# EAGLE schematic badge (EAGLE 7.7.0)

## Sheet 1 of 2
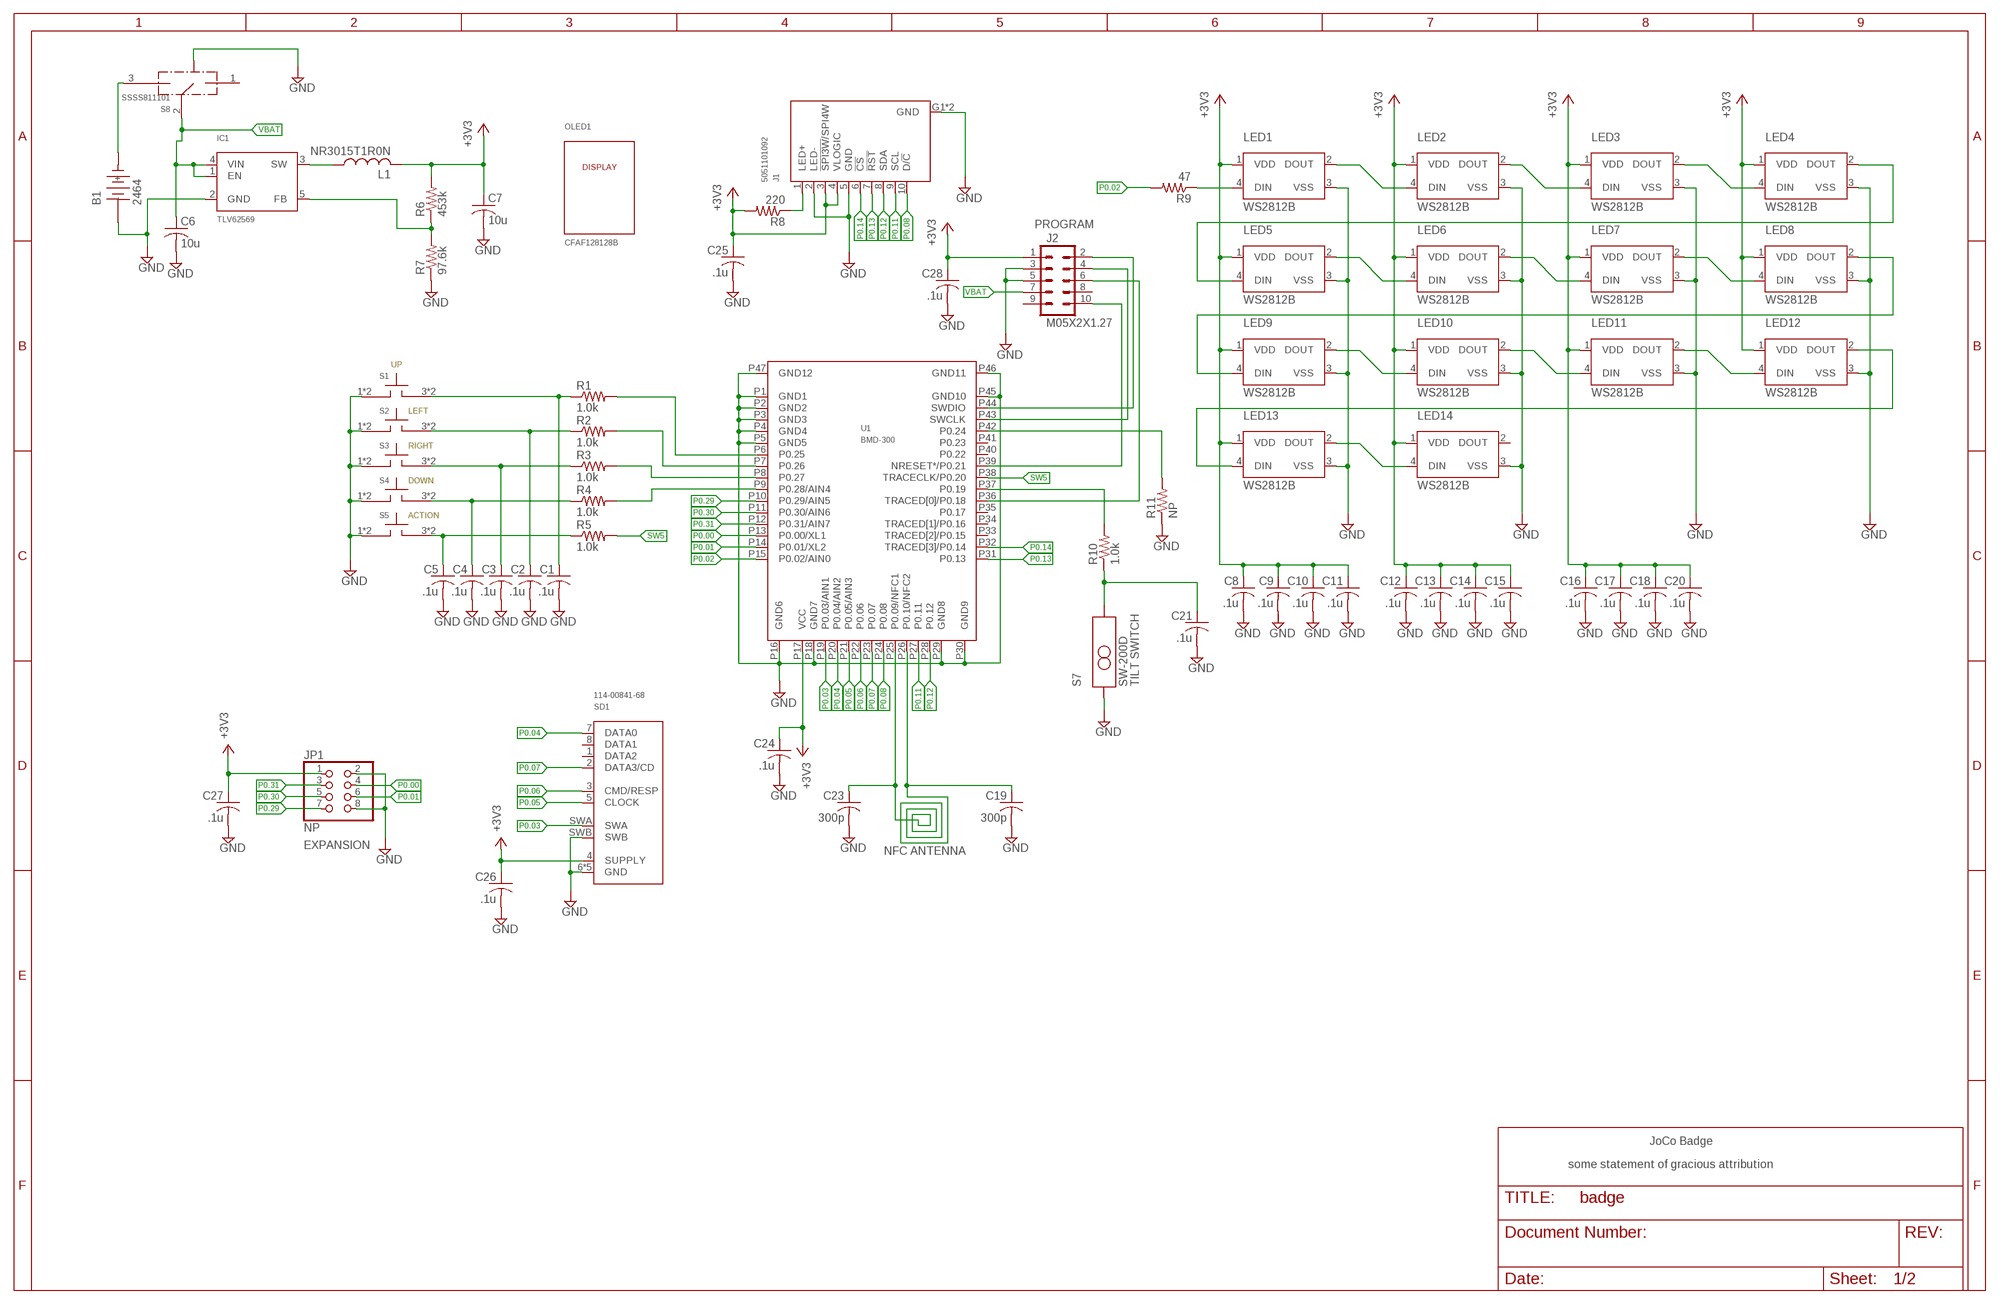
[diagram p0: schematic, sheet 1]

### Parts
B1  2464  [2464]
C1  .1u  C-USC0402K  [C0402K]
C2  .1u  C-USC0402K  [C0402K]
C3  .1u  C-USC0402K  [C0402K]
C4  .1u  C-USC0402K  [C0402K]
C5  .1u  C-USC0402K  [C0402K]
C6  10u  C-USC0805K  [C0805K]
C7  10u  C-USC0805K  [C0805K]
C8  .1u  C-USC0402K  [C0402K]
C9  .1u  C-USC0402K  [C0402K]
C10  .1u  C-USC0402K  [C0402K]
C11  .1u  C-USC0402K  [C0402K]
C12  .1u  C-USC0402K  [C0402K]
C13  .1u  C-USC0402K  [C0402K]
C14  .1u  C-USC0402K  [C0402K]
C15  .1u  C-USC0402K  [C0402K]
C16  .1u  C-USC0402K  [C0402K]
C17  .1u  C-USC0402K  [C0402K]
C18  .1u  C-USC0402K  [C0402K]
C19  300p  C-USC0603K  [C0603K]
C20  .1u  C-USC0402K  [C0402K]
C21  .1u  C-USC0402K  [C0402K]
C23  300p  C-USC0603K  [C0603K]
C24  .1u  C-USC0402K  [C0402K]
C25  .1u  C-USC0402K  [C0402K]
C26  .1u  C-USC0402K  [C0402K]
C27  .1u  C-USC0402K  [C0402K]
C28  .1u  C-USC0402K  [C0402K]
IC1  TLV62569  [DBV-5]
J1  5051101092  [5051101092]
J2  M05X2X1.27  [2X5X1.27]
JP1  NP  PINHD-2X4  [2X04]
L1  NR3015T1R0N  NR3015  [NR3015]
LED1  WS2812B  [WS2812B]
LED2  WS2812B  [WS2812B]
LED3  WS2812B  [WS2812B]
LED4  WS2812B  [WS2812B]
LED5  WS2812B  [WS2812B]
LED6  WS2812B  [WS2812B]
LED7  WS2812B  [WS2812B]
LED8  WS2812B  [WS2812B]
LED9  WS2812B  [WS2812B]
LED10  WS2812B  [WS2812B]
LED11  WS2812B  [WS2812B]
LED12  WS2812B  [WS2812B]
LED13  WS2812B  [WS2812B]
LED14  WS2812B  [WS2812B]
OLED1  CFAF128128B  [CFAF128128B]
R1  1.0k  R-US_R0603  [R0603]
R2  1.0k  R-US_R0603  [R0603]
R3  1.0k  R-US_R0603  [R0603]
R4  1.0k  R-US_R0603  [R0603]
R5  1.0k  R-US_R0603  [R0603]
R6  453k  R-US_R0603  [R0603]
R7  97.6k  R-US_R0603  [R0603]
R8  220  R-US_R0603  [R0603]
R9  47  R-US_R0603  [R0603]
R10  1.0k  R-US_R0603  [R0603]
R11  NP  R-US_R0805  [R0805]
S1  PTS810  [PTS810]
S2  PTS810  [PTS810]
S3  PTS810  [PTS810]
S4  PTS810  [PTS810]
S5  PTS810  [PTS810]
S7  SW-200D  [SW-200D]
S8  SSSS811101  [SSSS811101]
SD1  114-00841-68  [114-00841-68]
U1  BMD-300  [BMD-300]

### Nets
!RESET: J2.10 U1.P39(NRESET*/P0.21)
+3V3: C7.1 C8.1 C9.1 C10.1 C11.1 C12.1 C13.1 C14.1 C15.1 C16.1 C17.1 C18.1 C20.1 C24.1 C25.1 C26.1 C27.1 C28.1 J1.3(!SPI3W!/SPI4W) J1.4(VLOGIC) J2.1 JP1.1 L1.2 LED1.1(VDD) LED2.1(VDD) LED3.1(VDD) LED4.1(VDD) LED5.1(VDD) LED6.1(VDD) LED7.1(VDD) LED8.1(VDD) LED9.1(VDD) LED10.1(VDD) LED11.1(VDD) LED12.1(VDD) LED13.1(VDD) LED14.1(VDD) R6.2 R8.2 SD1.4(SUPPLY) U1.P17(VCC)
ANT: C19.1 C23.1 U1.P25(P0.09/NFC1) U1.P26(P0.10/NFC2)
FB: IC1.5(FB) R6.1 R7.2
GND: B1.- C1.2 C2.2 C3.2 C4.2 C5.2 C6.2 C7.2 C8.2 C9.2 C10.2 C11.2 C12.2 C13.2 C14.2 C15.2 C16.2 C17.2 C18.2 C19.2 C20.2 C21.2 C23.2 C24.2 C25.2 C26.2 C27.2 C28.2 IC1.2(GND) J1.2(LED-) J1.5(GND) J1.G1(GND) J1.G2(GND) J2.3 J2.5 JP1.2 JP1.8 LED1.3(VSS) LED2.3(VSS) LED3.3(VSS) LED4.3(VSS) LED5.3(VSS) LED6.3(VSS) LED7.3(VSS) LED8.3(VSS) LED9.3(VSS) LED10.3(VSS) LED11.3(VSS) LED12.3(VSS) LED13.3(VSS) LED14.3(VSS) R7.1 R11.1 S1.1(A) S1.2(A) S2.1(A) S2.2(A) S3.1(A) S3.2(A) S4.1(A) S4.2(A) S5.1(A) S5.2(A) S7.A S8.G1(GND) S8.G2(GND) S8.G3(GND) S8.G4(GND) SD1.6(GND) SD1.G1(GND) SD1.G2(GND) SD1.G3(GND) SD1.G4(GND) SD1.SWB U1.P1(GND1) U1.P2(GND2) U1.P3(GND3) U1.P4(GND4) U1.P5(GND5) U1.P16(GND6) U1.P18(GND7) U1.P29(GND8) U1.P30(GND9) U1.P45(GND10) U1.P46(GND11) U1.P47(GND12)
N$1: C1.1 R1.1 S1.3(B) S1.4(B)
N$2: C2.1 R2.1 S2.3(B) S2.4(B)
N$3: C3.1 R3.1 S3.3(B) S3.4(B)
N$4: C4.1 R4.1 S4.3(B) S4.4(B)
N$5: C5.1 R5.1 S5.3(B) S5.4(B)
N$6: R1.2 U1.P6(P0.25)
N$7: R2.2 U1.P7(P0.26)
N$8: R3.2 U1.P8(P0.27)
N$9: R4.2 U1.P9(P0.28/AIN4)
N$10: R11.2 U1.P42(P0.24)
N$11: C21.1 R10.1 S7.C
N$13: J1.1(LED+) R8.1
N$15: LED5.2(DOUT) LED6.4(DIN)
N$16: LED9.2(DOUT) LED10.4(DIN)
N$17: LED13.2(DOUT) LED14.4(DIN)
N$18: LED1.2(DOUT) LED2.4(DIN)
N$19: LED6.2(DOUT) LED7.4(DIN)
N$20: LED10.2(DOUT) LED11.4(DIN)
N$22: LED3.2(DOUT) LED4.4(DIN)
N$23: LED7.2(DOUT) LED8.4(DIN)
N$24: LED2.2(DOUT) LED3.4(DIN)
N$25: LED11.2(DOUT) LED12.4(DIN)
N$27: LED4.2(DOUT) LED5.4(DIN)
N$28: LED8.2(DOUT) LED9.4(DIN)
N$29: LED12.2(DOUT) LED13.4(DIN)
N$30: LED1.4(DIN) R9.1
P0.00: JP1.4 U1.P13(P0.00/XL1)
P0.01: JP1.6 U1.P14(P0.01/XL2)
P0.02: R9.2 U1.P15(P0.02/AIN0)
P0.03: SD1.SWA U1.P19(P0.03/AIN1)
P0.04: SD1.7(DATA0) U1.P20(P0.04/AIN2)
P0.05: SD1.5(CLOCK) U1.P21(P0.05/AIN3)
P0.06: SD1.3(CMD/RESP) U1.P22(P0.06)
P0.07: SD1.2(DATA3/CD) U1.P23(P0.07)
P0.08: J1.10(D/!C) U1.P24(P0.08)
P0.11: J1.9(SCL) U1.P27(P0.11)
P0.12: J1.8(SDA) U1.P28(P0.12)
P0.13: J1.7(!RST) U1.P31(P0.13)
P0.14: J1.6(!CS) U1.P32(TRACED[3]/P0.14)
P0.18: J2.6 U1.P36(TRACED[0]/P0.18)
P0.19: R10.2 U1.P37(P0.19)
P0.29: JP1.7 U1.P10(P0.29/AIN5)
P0.30: JP1.5 U1.P11(P0.30/AIN6)
P0.31: JP1.3 U1.P12(P0.31/AIN7)
SW: IC1.3(SW) L1.1
SW5: R5.2 U1.P38(TRACECLK/P0.20)
SWCLK: J2.4 U1.P43(SWCLK)
SWDIO: J2.2 U1.P44(SWDIO)
VBAT: C6.1 IC1.1(EN) IC1.4(VIN) J2.7 S8.2
VIN: B1.+ S8.3
Unconnected: J2.8 J2.9 LED14.2(DOUT) S8.1 SD1.1(DATA2) SD1.8(DATA1) U1.P33(TRACED[2]/P0.15) U1.P34(TRACED[1]/P0.16) U1.P35(P0.17) U1.P40(P0.22) U1.P41(P0.23)

### Notes on the sheet
- PROGRAM
- UP
- LEFT
- RIGHT
- DOWN
- ACTION
- TILT SWITCH
- EXPANSION
- NFC ANTENNA
- JoCo Badge
- some statement of gracious attribution

## Sheet 2 of 2
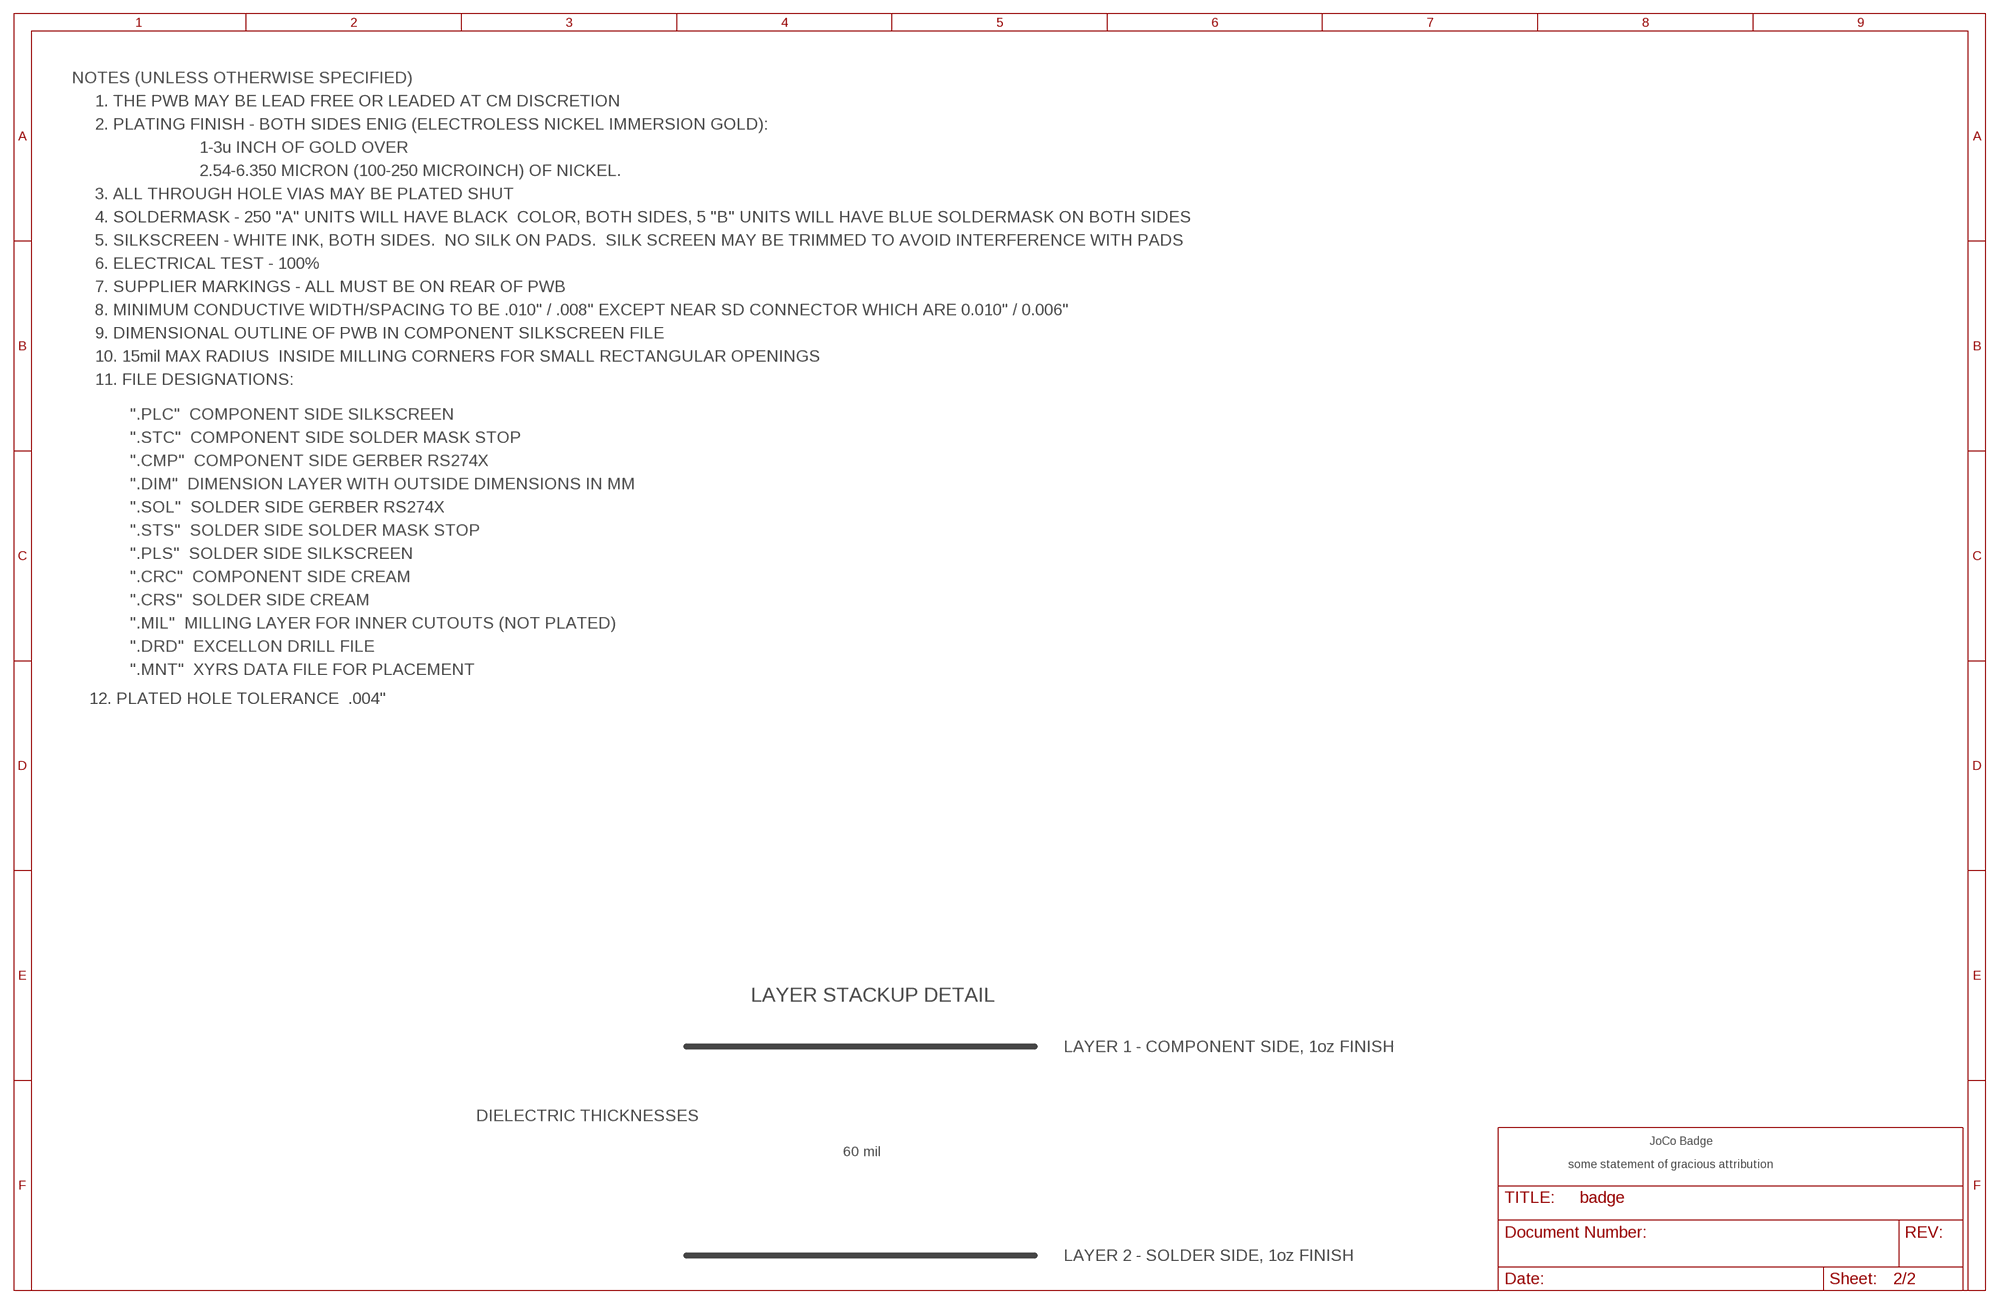
[diagram p1: schematic, sheet 2]

### Notes on the sheet
- NOTES (UNLESS OTHERWISE SPECIFIED)
- 1. THE PWB MAY BE LEAD FREE OR LEADED AT CM DISCRETION
- 2. PLATING FINISH - BOTH SIDES ENIG (ELECTROLESS NICKEL IMMERSION GOLD):
- 1-3u INCH OF GOLD OVER
- 2.54-6.350 MICRON (100-250 MICROINCH) OF NICKEL.
- 3. ALL THROUGH HOLE VIAS MAY BE PLATED SHUT
- 4. SOLDERMASK - 250 "A" UNITS WILL HAVE BLACK  COLOR, BOTH SIDES, 5 "B" UNITS WILL HAVE BLUE SOLDERMASK ON BOTH SIDES
- 5. SILKSCREEN - WHITE INK, BOTH SIDES.  NO SILK ON PADS.  SILK SCREEN MAY BE TRIMMED TO AVOID INTERFERENCE WITH PADS
- 6. ELECTRICAL TEST - 100%
- 7. SUPPLIER MARKINGS - ALL MUST BE ON REAR OF PWB
- 8. MINIMUM CONDUCTIVE WIDTH/SPACING TO BE .010" / .008" EXCEPT NEAR SD CONNECTOR WHICH ARE 0.010" / 0.006"
- 9. DIMENSIONAL OUTLINE OF PWB IN COMPONENT SILKSCREEN FILE
- 10. 15mil MAX RADIUS  INSIDE MILLING CORNERS FOR SMALL RECTANGULAR OPENINGS
- 11. FILE DESIGNATIONS:
- ".PLC"  COMPONENT SIDE SILKSCREEN
- ".STC"  COMPONENT SIDE SOLDER MASK STOP
- ".CMP"  COMPONENT SIDE GERBER RS274X
- ".DIM"  DIMENSION LAYER WITH OUTSIDE DIMENSIONS IN MM
- ".SOL"  SOLDER SIDE GERBER RS274X
- ".STS"  SOLDER SIDE SOLDER MASK STOP
- ".PLS"  SOLDER SIDE SILKSCREEN
- ".CRC"  COMPONENT SIDE CREAM
- ".CRS"  SOLDER SIDE CREAM
- ".MIL"  MILLING LAYER FOR INNER CUTOUTS (NOT PLATED)
- ".DRD"  EXCELLON DRILL FILE
- ".MNT"  XYRS DATA FILE FOR PLACEMENT
- 12. PLATED HOLE TOLERANCE  .004"
- LAYER STACKUP DETAIL
- LAYER 1 - COMPONENT SIDE, 1oz FINISH
- DIELECTRIC THICKNESSES
- JoCo Badge
- 60 mil
- some statement of gracious attribution
- LAYER 2 - SOLDER SIDE, 1oz FINISH

## Library data of the parts
B1 = badge:2464
C1-C5 C8-C21 C23-C28 = rcl:C-US: CAPACITOR, American symbol
C6 C7 = rcl:C-US: CAPACITOR, American symbol; MPN: JMK212BJ106KD-T
IC1 = badge:TLV62569
J1 = badge:5051101092
J2 = badge:M05X2X1.27
JP1 = pinhead:PINHD-2X4: PIN HEADER
L1 = badge:NR3015
LED1-LED14 = badge:WS2812B
OLED1 = badge:CFAF128128B
R1-R11 = rcl:R-US_: RESISTOR, American symbol
S1-S5 = badge:PTS810
S7 = badge:SW-200D
S8 = badge:SSSS811101
SD1 = badge:114-00841-68
U1 = BMD-300:BMD-300